# EAGLE schematic Voicecard-SMRMU-v02 (EAGLE 9.6.2)
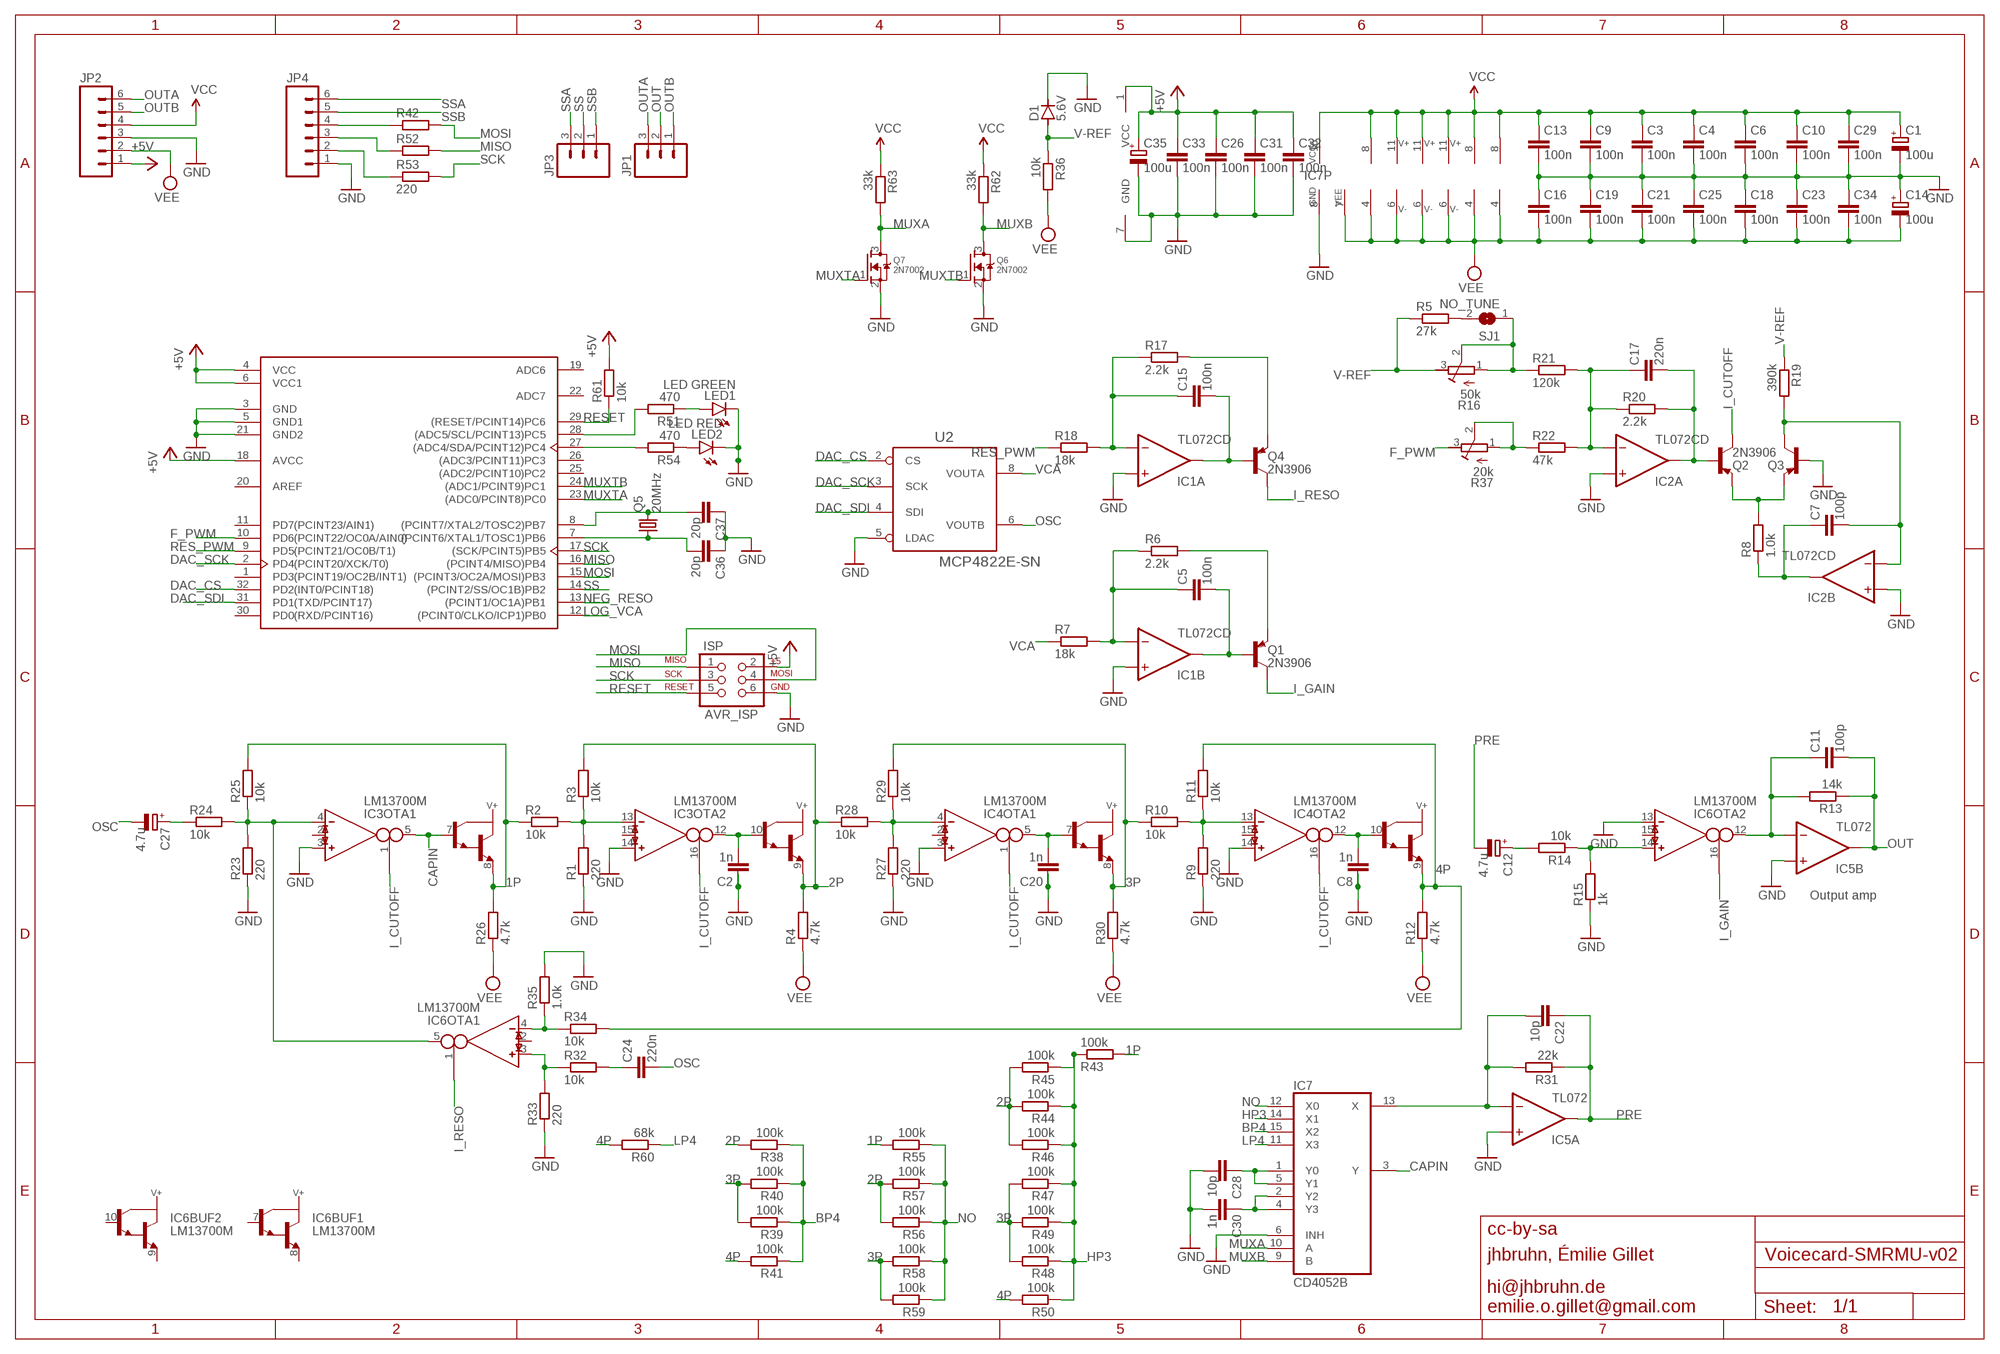
[diagram p0: schematic, sheet 1]

## Parts
C1  100u  CPOL-EUUD-6,3X7,7  [UD-6,3X7,7_NICHICON]
C2  1n  C-EUC0603  [C0603]
C3  100n  C-EUC0603  [C0603]
C4  100n  C-EUC0603  [C0603]
C5  100n  C-EUC0603  [C0603]
C6  100n  C-EUC0603  [C0603]
C7  100p  C-EUC0603  [C0603]
C8  1n  C-EUC0603  [C0603]
C9  100n  C-EUC0603  [C0603]
C10  100n  C-EUC0603  [C0603]
C11  100p  C-EUC0603  [C0603]
C12  4.7u  CPOL-EUUD-5X5,8  [UD-5X5,8_NICHICON]
C13  100n  C-EUC0603  [C0603]
C14  100u  CPOL-EUUD-6,3X7,7  [UD-6,3X7,7_NICHICON]
C15  100n  C-EUC0603  [C0603]
C16  100n  C-EUC0603  [C0603]
C17  220n  C-EUC0603  [C0603]
C18  100n  C-EUC0603  [C0603]
C19  100n  C-EUC0603  [C0603]
C20  1n  C-EUC0603  [C0603]
C21  100n  C-EUC0603  [C0603]
C22  10p  C-EUC0603  [C0603]
C23  100n  C-EUC0603  [C0603]
C24  220n  C-EUC0603  [C0603]
C25  100n  C-EUC0603  [C0603]
C26  100n  C-EUC0603  [C0603]
C27  4.7u  CPOL-EUUD-5X5,8  [UD-5X5,8_NICHICON]
C28  10p  C-EUC0603  [C0603]
C29  100n  C-EUC0603  [C0603]
C30  1n  C-EUC0603  [C0603]
C31  100n  C-EUC0603  [C0603]
C32  100n  C-EUC0603  [C0603]
C33  100n  C-EUC0603  [C0603]
C34  100n  C-EUC0603  [C0603]
C35  100u  CPOL-EUUD-6,3X7,7  [UD-6,3X7,7_NICHICON]
C36  20p  C-EUC0603  [C0603]
C37  20p  C-EUC0603  [C0603]
D1  5.6V  DIODE-LL-34  [MELF-MLL34]
IC1  TL072CD  [SOIC8]
IC2  TL072CD  [SOIC8]
IC3  LM13700M  [SO16]
IC4  LM13700M  [SO16]
IC5  TL072  TL072CD  [SOIC8]
IC6  LM13700M  [SO16]
IC7  CD4052B  [SOIC16N]
ISP  AVR_ISP  AVR_SPI_PRG_6PTH  [2X3]
JP1  M03PTH  [1X03]
JP2  M06SIP  [1X06]
JP3  M03PTH  [1X03]
JP4  M06SIP  [1X06]
LED1  LED GREEN  LED  [CHIP-LED0603]
LED2  LED RED  LED  [CHIP-LED0603]
Q1  2N3906  [SOT23-BEC]
Q2  2N3906  [SOT23-BEC]
Q3  2N3906  [SOT23-BEC]
Q4  2N3906  [SOT23-BEC]
Q5  20MHz  CRYSTALHC49UP  [HC49UP]
Q6  2N7002  MOSFET-NREFLOW  [SOT23]
Q7  2N7002  MOSFET-NREFLOW  [SOT23]
R1  220  R-EU_R0603  [R0603]
R2  10k  R-EU_R0603  [R0603]
R3  10k  R-EU_R0603  [R0603]
R4  4.7k  R-EU_R0603  [R0603]
R5  27k  R-EU_R0603  [R0603]
R6  2.2k  R-EU_R0603  [R0603]
R7  18k  R-EU_R0603  [R0603]
R8  1.0k  R-EU_R0603  [R0603]
R9  220  R-EU_R0603  [R0603]
R10  10k  R-EU_R0603  [R0603]
R11  10k  R-EU_R0603  [R0603]
R12  4.7k  R-EU_R0603  [R0603]
R13  14k  R-EU_R0603  [R0603]
R14  10k  R-EU_R0603  [R0603]
R15  1k  R-EU_R0603  [R0603]
R16  50k  R-TRIMM3296P  [RTRIM3296P]
R17  2.2k  R-EU_R0603  [R0603]
R18  18k  R-EU_R0603  [R0603]
R19  390k  R-EU_R0603  [R0603]
R20  2.2k  R-EU_R0603  [R0603]
R21  120k  R-EU_R0603  [R0603]
R22  47k  R-EU_R0603  [R0603]
R23  220  R-EU_R0603  [R0603]
R24  10k  R-EU_R0603  [R0603]
R25  10k  R-EU_R0603  [R0603]
R26  4.7k  R-EU_R0603  [R0603]
R27  220  R-EU_R0603  [R0603]
R28  10k  R-EU_R0603  [R0603]
R29  10k  R-EU_R0603  [R0603]
R30  4.7k  R-EU_R0603  [R0603]
R31  22k  R-EU_R0603  [R0603]
R32  10k  R-EU_R0603  [R0603]
R33  220  R-EU_R0603  [R0603]
R34  10k  R-EU_R0603  [R0603]
R35  1.0k  R-EU_R0603  [R0603]
R36  10k  R-EU_R0603  [R0603]
R37  20k  R-TRIMM3296P  [RTRIM3296P]
R38  100k  R-EU_R0603  [R0603]
R39  100k  R-EU_R0603  [R0603]
R40  100k  R-EU_R0603  [R0603]
R41  100k  R-EU_R0603  [R0603]
R42  220  R-EU_R0603  [R0603]
R43  100k  R-EU_R0603  [R0603]
R44  100k  R-EU_R0603  [R0603]
R45  100k  R-EU_R0603  [R0603]
R46  100k  R-EU_R0603  [R0603]
R47  100k  R-EU_R0603  [R0603]
R48  100k  R-EU_R0603  [R0603]
R49  100k  R-EU_R0603  [R0603]
R50  100k  R-EU_R0603  [R0603]
R51  470  R-EU_R0603  [R0603]
R52  220  R-EU_R0603  [R0603]
R53  220  R-EU_R0603  [R0603]
R54  470  R-EU_R0603  [R0603]
R55  100k  R-EU_R0603  [R0603]
R56  100k  R-EU_R0603  [R0603]
R57  100k  R-EU_R0603  [R0603]
R58  100k  R-EU_R0603  [R0603]
R59  100k  R-EU_R0603  [R0603]
R60  68k  R-EU_R0603  [R0603]
R61  10k  R-EU_R0603  [R0603]
R62  33k  R-EU_R0603  [R0603]
R63  33k  R-EU_R0603  [R0603]
SJ1  NO_TUNE  SJ  [SJ]
U1  ATMEGA328P-AU  [TQFP-32]
U2  MCP4822E-SN  [SOIC8]

## Nets
1P: IC3.8(BUF1:E) R2.1 R25.2 R26.2 R43.2 R55.2
2P: IC3.9(BUF2:E) R3.2 R4.2 R28.1 R38.2 R44.2 R45.2 R46.2 R56.2 R57.2
3P: IC4.8(BUF1:E) R10.1 R29.2 R30.2 R39.2 R40.2 R47.2 R48.2 R49.2 R58.2 R59.2
4P: IC4.9(BUF2:E) R11.2 R12.2 R34.2 R41.2 R50.2 R60.2
+5V [power]: C26.1 C31.1 C32.1 C33.1 C35.+ ISP.2 JP2.1 R61.2 U1.4(VCC) U1.6(VCC1) U1.18(AVCC) U2.1(VCC)
BP4: IC7.15(X2) R38.1 R39.1 R40.1 R41.1
CAPIN: IC3.5(OTA1:OUT) IC3.7(BUF1:B) IC7.3(Y)
DAC_CS: U1.32(PD2(INT0/PCINT18)) U2.2(CS)
DAC_SCK: U1.2(PD4(PCINT20/XCK/T0)) U2.3(SCK)
DAC_SDI: U1.31(PD1(TXD/PCINT17)) U2.4(SDI)
F_PWM: R37.3(E) U1.10(PD6(PCINT22/OC0A/AIN0))
GND [power]: C1.- C2.1 C3.2 C4.2 C6.2 C8.1 C9.2 C10.2 C13.2 C14.+ C16.1 C18.1 C19.1 C20.1 C21.1 C23.1 C25.1 C26.2 C28.2 C29.2 C30.2 C31.2 C32.2 C33.2 C34.1 C35.- C36.1 C37.1 D1.1(C) IC1.3(A:+IN) IC1.5(B:+IN) IC2.3(A:+IN) IC2.5(B:+IN) IC3.3(OTA1:IN_P) IC3.14(OTA2:IN_P) IC4.3(OTA1:IN_P) IC4.14(OTA2:IN_P) IC5.3(A:+IN) IC5.5(B:+IN) IC6.13(OTA2:IN_N) IC7.6(INH) IC7.8(GND) ISP.6 JP2.3 JP4.1 LED1.C LED2.C Q3.B Q6.2(S) Q7.2(S) R1.1 R9.1 R15.1 R23.1 R27.1 R33.1 R35.2 U1.3(GND) U1.5(GND1) U1.21(GND2) U2.5(LDAC) U2.7(GND)
HP3: IC7.14(X1) R43.1 R44.1 R45.1 R46.1 R47.1 R48.1 R49.1 R50.1
I_CUTOFF: IC3.1(OTA1:I_BIAS) IC3.16(OTA2:I_BIAS) IC4.1(OTA1:I_BIAS) IC4.16(OTA2:I_BIAS) Q2.C
I_GAIN: IC6.16(OTA2:I_BIAS) Q1.C
I_RESO: IC6.1(OTA1:I_BIAS) Q4.C
LOG_VCA: U1.12((PCINT0/CLKO/ICP1)PB0)
LP4: IC7.11(X3) R60.1
MISO: ISP.1 R52.2 U1.16((PCINT4/MISO)PB4)
MOSI: ISP.4 R42.2 U1.15((PCINT3/OC2A/MOSI)PB3)
MUXA: IC7.10(A) Q7.3(D) R63.2
MUXB: IC7.9(B) Q6.3(D) R62.2
MUXTA: Q7.1(G) U1.23((ADC0/PCINT8)PC0)
MUXTB: Q6.1(G) U1.24((ADC1/PCINT9)PC1)
N$1: Q2.E Q3.E R8.2
N$2: C17.2 IC2.1(A:OUT) Q2.B R20.2
N$3: C36.2 Q5.1 U1.7((PCINT6/XTAL1/TOSC1)PB6)
N$4: C7.2 IC2.6(B:-IN) Q3.C R19.2
N$5: C27.+ R24.1
N$6: C28.1 IC7.1(Y0) IC7.5(Y1)
N$7: LED1.A R51.1
N$8: JP4.2 R53.1
N$9: C7.1 IC2.7(B:OUT) R8.1
N$10: LED2.A R54.1
N$11: R54.2 U1.27((ADC4/SDA/PCINT12)PC4)
N$12: IC3.4(OTA1:IN_N) IC6.5(OTA1:OUT) R23.2 R24.2 R25.1
N$13: JP4.3 R52.1
N$14: C37.2 Q5.2 U1.8((PCINT7/XTAL2/TOSC2)PB7)
N$15: C22.2 IC5.2(A:-IN) IC7.13(X) R31.2
N$16: R16.1(A) R16.2(S) R21.1 SJ1.1
N$17: IC3.13(OTA2:IN_N) R1.2 R2.2 R3.1
N$18: JP4.4 R42.1
N$19: C2.2 IC3.10(BUF2:B) IC3.12(OTA2:OUT)
N$20: R51.2 U1.28((ADC5/SCL/PCINT13)PC5)
N$21: IC4.4(OTA1:IN_N) R27.2 R28.2 R29.1
N$22: C30.1 IC7.2(Y2) IC7.4(Y3)
N$23: C20.2 IC4.5(OTA1:OUT) IC4.7(BUF1:B)
N$24: IC4.13(OTA2:IN_N) R9.2 R10.2 R11.1
N$26: R5.2 SJ1.2
N$27: C12.+ R14.2
N$28: C8.2 IC4.10(BUF2:B) IC4.12(OTA2:OUT)
N$29: IC6.4(OTA1:IN_N) R34.1 R35.1
N$30: C15.2 IC1.1(A:OUT) Q4.B
N$31: C5.2 IC1.7(B:OUT) Q1.B
N$32: C24.1 R32.2
N$33: IC6.3(OTA1:IN_P) R32.1 R33.2
N$34: IC6.14(OTA2:IN_P) R14.1 R15.2
N$40: C17.1 IC2.2(A:-IN) R20.1 R21.2 R22.2
N$41: R22.1 R37.1(A) R37.2(S)
N$51: C5.1 IC1.6(B:-IN) R6.1 R7.2
N$57: C15.1 IC1.2(A:-IN) R17.1 R18.2
N$60: Q4.E R17.2
N$68: Q1.E R6.2
N$70: C11.1 IC5.6(B:-IN) IC6.12(OTA2:OUT) R13.2
NEG_RESO: U1.13((PCINT1/OC1A)PB1)
NO: IC7.12(X0) R55.1 R56.1 R57.1 R58.1 R59.1
OSC: C24.2 C27.- U2.6(VOUTB)
OUT: C11.2 IC5.7(B:OUT) JP1.2 R13.1
OUTA: JP1.3 JP2.6
OUTB: JP1.1 JP2.5
PRE: C12.- C22.1 IC5.1(A:OUT) R31.1
RES_PWM: R18.1 U1.9(PD5(PCINT21/OC0B/T1))
RESET: ISP.5 R61.1 U1.29((RESET/PCINT14)PC6)
SCK: ISP.3 R53.2 U1.17((SCK/PCINT5)PB5)
SS: JP3.2 U1.14((PCINT2/SS/OC1B)PB2)
SSA: JP3.3 JP4.6
SSB: JP3.1 JP4.5
V-REF: D1.2(A) R5.1 R16.3(E) R19.1 R36.1
VCA: R7.1 U2.8(VOUTA)
VCC [power]: C1.+ C3.1 C4.1 C6.1 C9.1 C10.1 C13.1 C29.1 IC1.8(P:V+) IC2.8(P:V+) IC3.11(SUPPLY:V+) IC4.11(SUPPLY:V+) IC5.8(P:V+) IC6.11(SUPPLY:V+) IC7.16(VCC) JP2.4 R62.1 R63.1
VEE [power]: C14.- C16.2 C18.2 C19.2 C21.2 C23.2 C25.2 C34.2 IC1.4(P:V-) IC2.4(P:V-) IC3.6(SUPPLY:V-) IC4.6(SUPPLY:V-) IC5.4(P:V-) IC6.6(SUPPLY:V-) IC7.7(VEE) JP2.2 R4.1 R12.1 R26.1 R30.1 R36.2
Unconnected: IC3.2(OTA1:I_DIODE) IC3.15(OTA2:I_DIODE) IC4.2(OTA1:I_DIODE) IC4.15(OTA2:I_DIODE) IC6.2(OTA1:I_DIODE) IC6.7(BUF1:B) IC6.8(BUF1:E) IC6.9(BUF2:E) IC6.10(BUF2:B) IC6.15(OTA2:I_DIODE) U1.1(PD3(PCINT19/OC2B/INT1)) U1.11(PD7(PCINT23/AIN1)) U1.19(ADC6) U1.22(ADC7) U1.25((ADC2/PCINT10)PC2) U1.26((ADC3/PCINT11)PC3) U1.30(PD0(RXD/PCINT16))

## Notes on the sheet
- Output amp
- cc-by-sa
- jhbruhn, Émilie Gillet
- hi@jhbruhn.de
  emilie.o.gillet@gmail.com

## Power pins joined to a net without a drawn wire
AREF: U1.20(AREF)

## Library data of the parts
C1 C12 C14 C27 C35 = jhbruhn-cdr:CPOL-EU: POLARIZED CAPACITOR, European symbol; SPICEPREFIX: C
C2-C11 C13 C15-C26 C28-C34 C36 C37 = jhbruhn-cdr:C-EU: CAPACITOR, European symbol; SPICEPREFIX: C
D1 = jhbruhn-cdr:DIODE-: DIODE
IC1 IC2 IC5 = jhbruhn-opamp:TL072: Generic Dual Op Amp
IC3 IC4 IC6 = jhbruhn-ota:LM13700: Dual OTA with buffers
IC7 = jhbruhn-ic:CD4052: 8-channel ANALOG MULTIPLEXER
ISP = SparkFun:AVR_SPI_PRG_6: AVR ISP 6 Pin This is the reduced ISP connector for AVR programming. Common on Arduino. This footprint will take up less PCB space and can be used with a 10-pin to 6-pin adapter such as SKU: BOB-08508
JP1 JP3 = SparkFun:M03: Header 3 Standard 3-pin 0.1" header. Use with straight break away headers (SKU : PRT-00116), right angle break away headers (PRT-00553), swiss pins (PRT-00743), machine pins (PRT-00117), and female headers (PRT-00115). Molex polarized connector foot print use with SKU : PRT-08232 with associated crimp pins and housings.
JP2 JP4 = SparkFun:M06: Header 6 Standard 6-pin 0.1" header. Use with straight break away headers (SKU : PRT-00116), right angle break away headers (PRT-00553), swiss pins (PRT-00743), machine pins (PRT-00117), and female headers (PRT-00115). Molex polarized connector foot print use with SKU : PRT-08094 with associated crimp pins and housings. NOTES ON THE VARIANTS LOCK and LOCK_LONGPADS... This footprint was designed to help hold the alignment of a through-hole component (i.e. 6-pin header) while soldering it into place. You may notice that each hole has been shifted either up or down by 0.005 of an inch from it's more standard position (which is a perfectly straight line). This slight alteration caused the pins (the squares in the middle) to touch the edges of the holes. Because they are alternating, it causes a "brace" to hold the component in place. 0.005 has proven to be the perfect amount of "off-center" position when using our standard breakaway headers. Although looks a little odd when you look at the bare footprint, once you have a header in there, the alteration is very hard to notice. Also, if you push a header all the way into place, it is covered up entirely on the bottom side. This idea of altering the position of holes to aid alignment will be further integrated into the Sparkfun Library for other footprints. It can help hold any component with 3 or more connection pins.
LED1 LED2 = jhbruhn-physical:LED
Q1-Q4 = jhbruhn-transistor:2N3906
Q5 = crystal:CRYSTAL: CRYSTAL; OC_FARNELL: unknown; OC_NEWARK: unknown
Q6 Q7 = jhbruhn-transistor:MOSFET-N: N-Channel Mosfet 2N7002E - 60V 260mA SOT23 [Digikey: 2N7002ET1GOSTR-ND] - REEL BSH103 - 30V 850mA SOT23 [Digikey: 568-5013-1-ND]
R1-R15 R17-R36 R38-R63 = jhbruhn-cdr:R-EU_: RESISTOR, European symbol; SPICEPREFIX: R
R16 R37 = rcl:R-TRIMM: Trimm resistor; SPICEMODEL: X; SPICEPREFIXL: POT
SJ1 = jumper:SJ: SMD solder JUMPER
U1 = jhbruhn-mcu:ATMEGA328P-AU: IC MCU 8BIT 32KB FLASH 32TQFP Manufacturer's datasheet <http://ww1.microchip.com/downloads/en/DeviceDoc/ATmega48A-PA-88A-PA-168A-PA-328-P-DS-DS40002061A.pdf>; CREATED_BY: PCBLayout.com; DIGIKEY_PART_NUMBER: ATMEGA328P-AU-ND; MANUFACTURER: Microchip Technology; MPN: ATMEGA328P-AU; PACKAGE: TQFP-32
U2 = jhbruhn-dac:MCP48*2: MCP48X2 - dual channel, 8/10/12bit DAC, SPI interface, internal reference

## Net classes
0 default: width 0.254 mm
1 power: width 0.406 mm